# EasyEDA Pro project Lab 1 Schematic.eprj

# Schematic Schematic1
Board Name: Board1; Create Date: 2025-09-02; Page Name: P1; Project Name: Lab 1 Schematic; Schematic Name: Schematic1; Update Date: 2025-09-02; Company: 嘉立创EDA; Page Size: A4; Version: V1.0
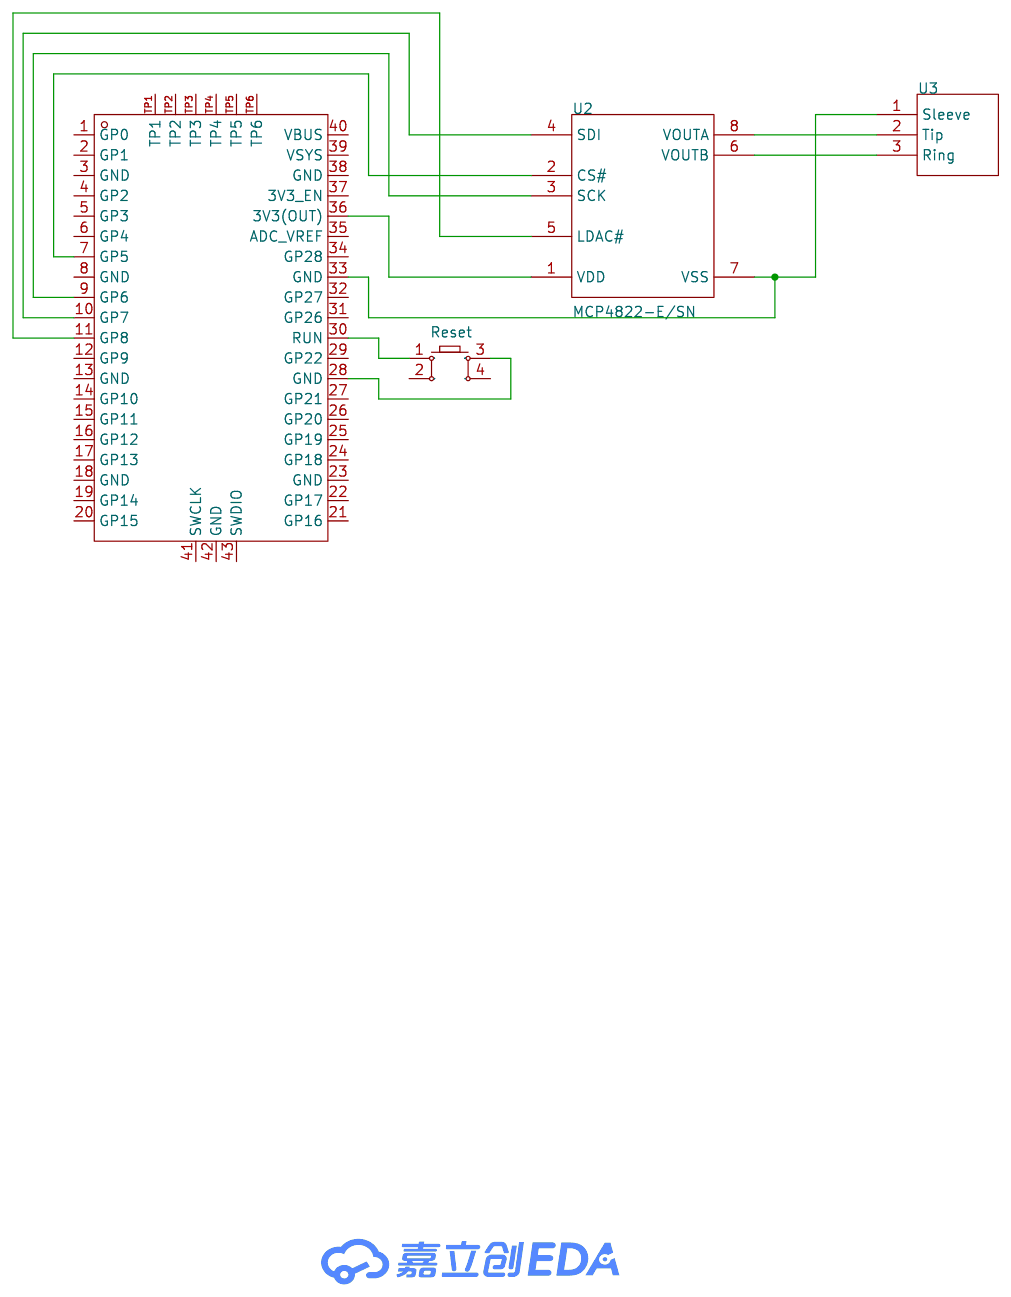
[diagram p0: schematic sheet]

## Parts
Reset  -  [Key_SMD_12x12x7.3]
U1  PICO  [COMM-SMD_L51.0-W21.0-P2.54_SC0916]
U2  MCP4822-E/SN  [SOIC-8_L4.9-W3.9-P1.27-LS6.0-BL]
U3  -

## Library data of the parts
Reset = Key_SMD_12x12x7.3: Supplier Footprint: SMD
U1 = PICO: Supplier Part: C7203002; Manufacturer: Raspberry Pi(树莓派); JLCPCB Part Class: 扩展库; Datasheet: https://atta.szlcsc.com/upload/public/pdf/source/20230906/086376002DDC9866828648BC93E51F8B.pdf; Supplier: LCSC
U2 = MCP4822-E/SN: Supplier Part: C16040; Manufacturer: MICROCHIP(美国微芯); Supplier Footprint: SOIC-8; JLCPCB Part Class: 扩展库; Datasheet: https://item.szlcsc.com/datasheet/MCP4822-E%252FSN/16722.html; Supplier: LCSC; Resolution(Bits): 12位; Number of Channels: 2; Interface: SPI; Voltage - Supply: 2.7V~5.5V; Settling Time: 4.5us; INL/DNL(LSB): 12LSB; Operating Temperature: -40℃~+125℃
U3 = 3.5mm Socket

## Nets
Net-(Reset-1): Reset.1 U1.30(RUN)
Net-(Reset-3): Reset.3 U1.28(GND)
Net-(U1-7): U1.7(GP5) U2.2(CS#)
Net-(U1-9): U1.9(GP6) U2.3(SCK)
Net-(U1-10): U1.10(GP7) U2.4(SDI)
Net-(U1-11): U1.11(GP8) U2.5(LDAC#)
Net-(U1-33): U1.33(GND) U2.7(VSS) U3.1(Sleeve)
Net-(U1-36): U1.36(3V3(OUT)) U2.1(VDD)
Net-(U2-6): U2.6(VOUTB) U3.3(Ring)
Net-(U2-8): U2.8(VOUTA) U3.2(Tip)

Not connected (* = marked no-connect by the designer): Reset 2 4; U1 1(GP0) 2(GP1) 3(GND) 4(GP2) 5(GP3) 6(GP4) 8(GND) 12(GP9) 13(GND) 14(GP10) 15(GP11) 16(GP12) 17(GP13) 18(GND) 19(GP14) 20(GP15) 21(GP16) 22(GP17) 23(GND) 24(GP18) 25(GP19) 26(GP20) 27(GP21) 29(GP22) 31(GP26) 32(GP27) 34(GP28) 35(ADC_VREF) 37(3V3_EN) 38(GND) 39(VSYS) 40(VBUS) 41(SWCLK) 42(GND) 43(SWDIO) TP1 TP2 TP3 TP4 TP5 TP6
